# EAGLE design magic-donut (EAGLE 7.5.0)
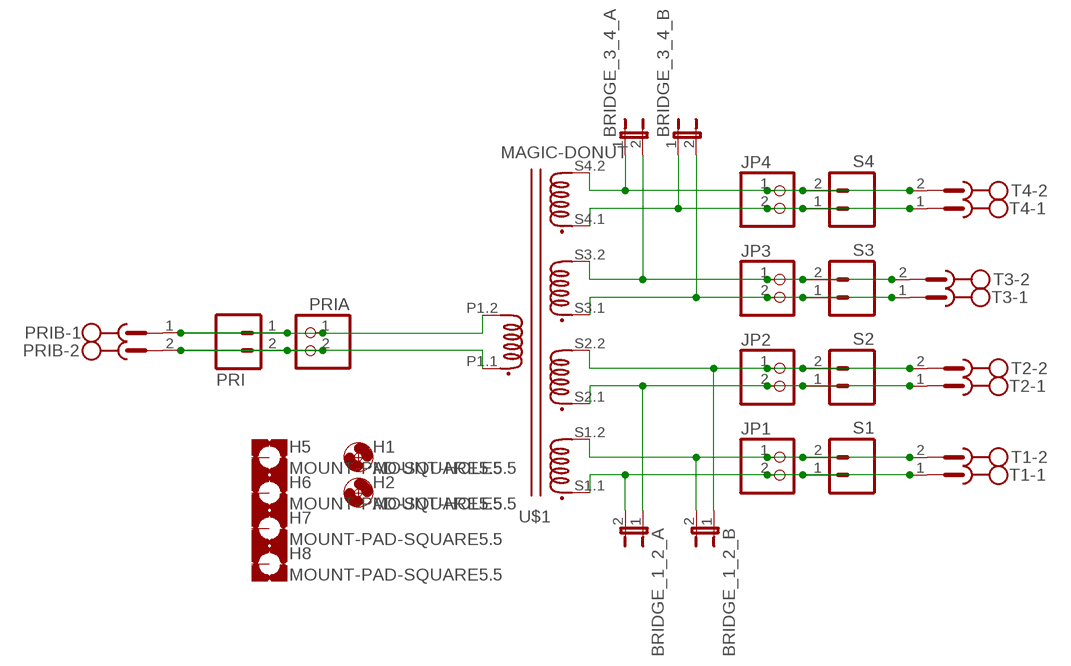
[diagram p0: schematic, sheet 1]

## Parts
BRIDGE_1_2_A  JP1E  [JP1]
BRIDGE_1_2_B  JP1E  [JP1]
BRIDGE_3_4_A  JP1E  [JP1]
BRIDGE_3_4_B  JP1E  [JP1]
H1  MOUNT-HOLE5.5  [5,5]
H2  MOUNT-HOLE5.5  [5,5]
H5  MOUNT-PAD-SQUARE5.5  [5,5-PAD-SQUARE]
H6  MOUNT-PAD-SQUARE5.5  [5,5-PAD-SQUARE]
H7  MOUNT-PAD-SQUARE5.5  [5,5-PAD-SQUARE]
H8  MOUNT-PAD-SQUARE5.5  [5,5-PAD-SQUARE]
JP1  PINHD-1X2  [1X02]
JP2  PINHD-1X2  [1X02]
JP3  PINHD-1X2  [1X02]
JP4  PINHD-1X2  [1X02]
PRI  M02JST-PTH-2  [JST-2-PTH]
PRIA  PINHD-1X2  [1X02]
PRIB  MSTBV2  [MSTBV2]
S1  M02JST-PTH-2  [JST-2-PTH]
S2  M02JST-PTH-2  [JST-2-PTH]
S3  M02JST-PTH-2  [JST-2-PTH]
S4  M02JST-PTH-2  [JST-2-PTH]
T1  MSTBV2  [MSTBV2]
T2  MSTBV2  [MSTBV2]
T3  MSTBV2  [MSTBV2]
T4  MSTBV2  [MSTBV2]
U$1  MAGIC-DONUT  [TOROID]

## Nets
N$1: BRIDGE_1_2_A.2 JP1.2 S1.1 T1.1 U$1.S1.1
N$2: BRIDGE_1_2_A.1 JP2.2 S2.1 T2.1 U$1.S2.1
N$3: BRIDGE_3_4_A.1 JP4.1 S4.2 T4.2 U$1.S4.2
N$4: BRIDGE_3_4_B.1 JP4.2 S4.1 T4.1 U$1.S4.1
N$5: BRIDGE_3_4_A.2 JP3.1 S3.2 T3.2 U$1.S3.2
N$6: BRIDGE_3_4_B.2 JP3.2 S3.1 T3.1 U$1.S3.1
N$7: BRIDGE_1_2_B.1 JP2.1 S2.2 T2.2 U$1.S2.2
N$9: BRIDGE_1_2_B.2 JP1.1 S1.2 T1.2 U$1.S1.2
N$11: PRI.1 PRIA.1 PRIB.1 U$1.P1.2
N$12: PRI.2 PRIA.2 PRIB.2 U$1.P1.1
Unconnected: H5.B5,5(MOUNT) H6.B5,5(MOUNT) H7.B5,5(MOUNT) H8.B5,5(MOUNT)

## Library data of the parts
BRIDGE_1_2_A BRIDGE_1_2_B BRIDGE_3_4_A BRIDGE_3_4_B = jumper:JP1E: JUMPER
H1 H2 = holes:MOUNT-HOLE: MOUNTING HOLE with drill center marker
H5-H8 = holes:MOUNT-PAD-SQUARE: MOUNTING PAD, square
JP1-JP4 PRIA = pinhead:PINHD-1X2: PIN HEADER
PRI S1-S4 = SparkFun-Connectors:M02: Standard 2-pin 0.1" header. Use with - straight break away headers ( PRT-00116) - right angle break away headers (PRT-00553) - swiss pins (PRT-00743) - machine pins (PRT-00117) - female headers (PRT-00115) Molex polarized connector foot print use with: PRT-08233 with associated crimp pins and housings. 2.54_SCREWTERM for use with PRT-10571. 3.5mm Screw Terminal footprints for PRT-08084 5mm Screw Terminal footprints for use with PRT-08432; PROD_ID: CONN-09863; SKU: PRT-09914
PRIB T1-T4 = con-phoenix-500:MSTBV2: PHOENIX; OC_FARNELL: unknown; OC_NEWARK: unknown
U$1 = magic-donut:MAGIC-DONUT

## Board
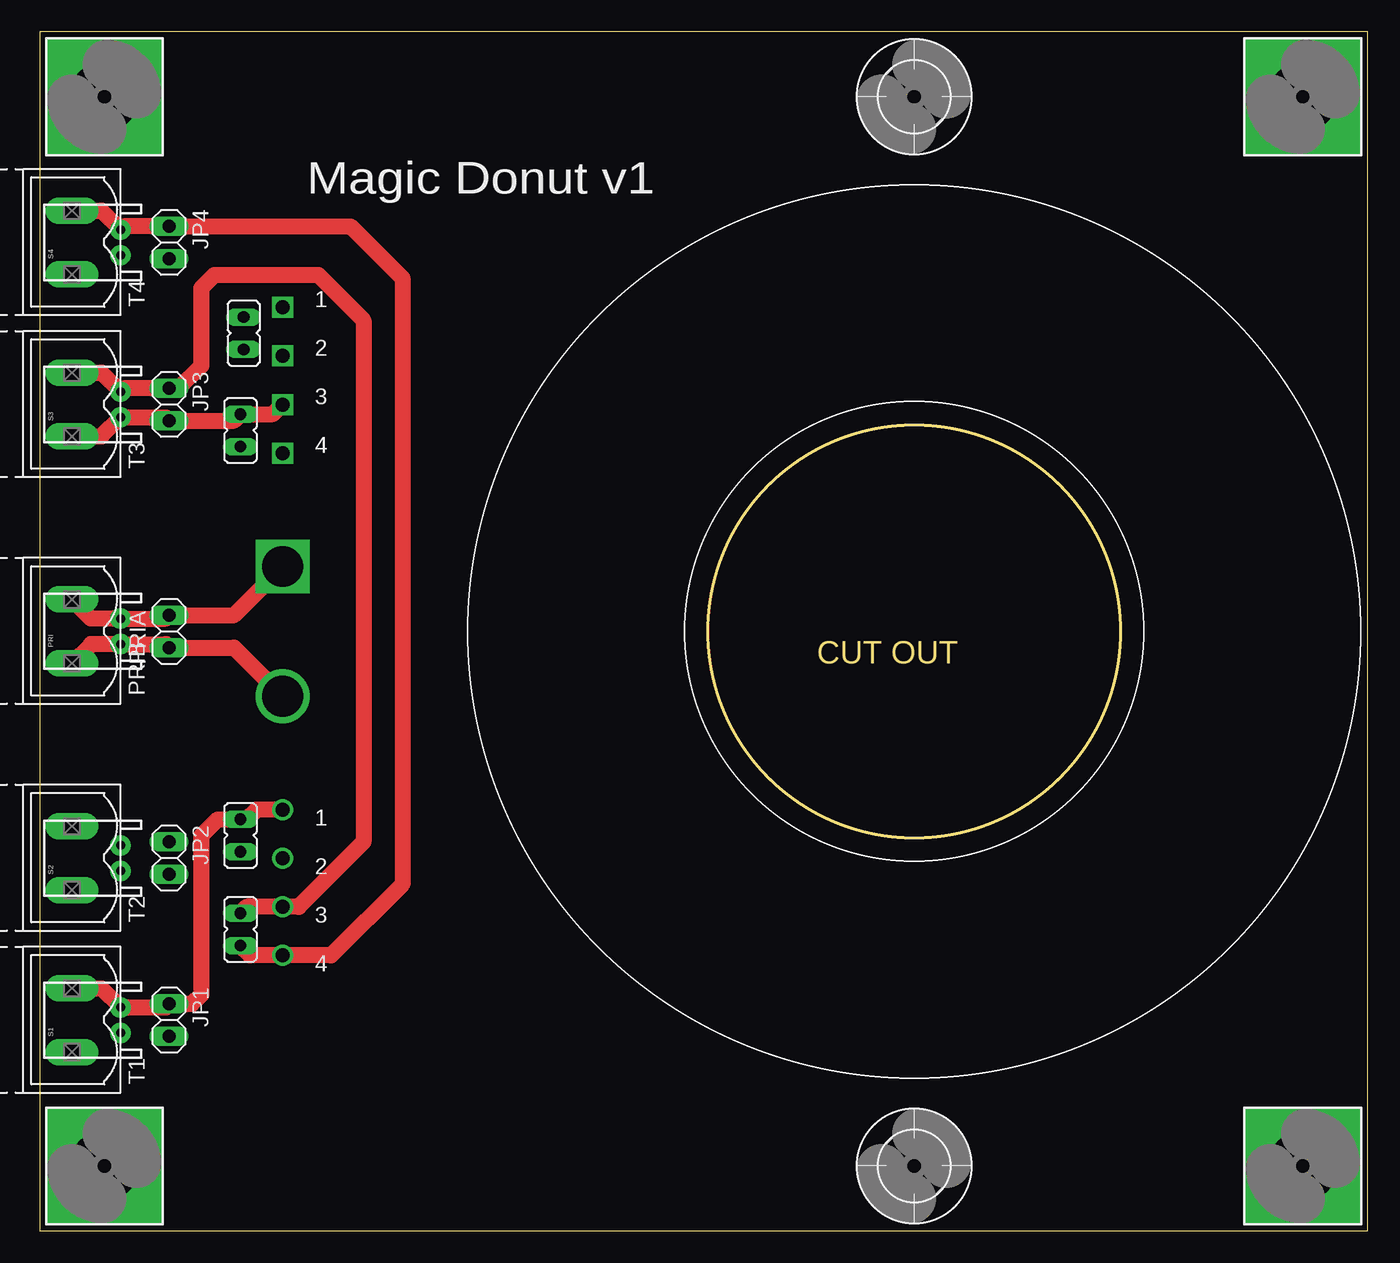
[diagram p1: board, top side]
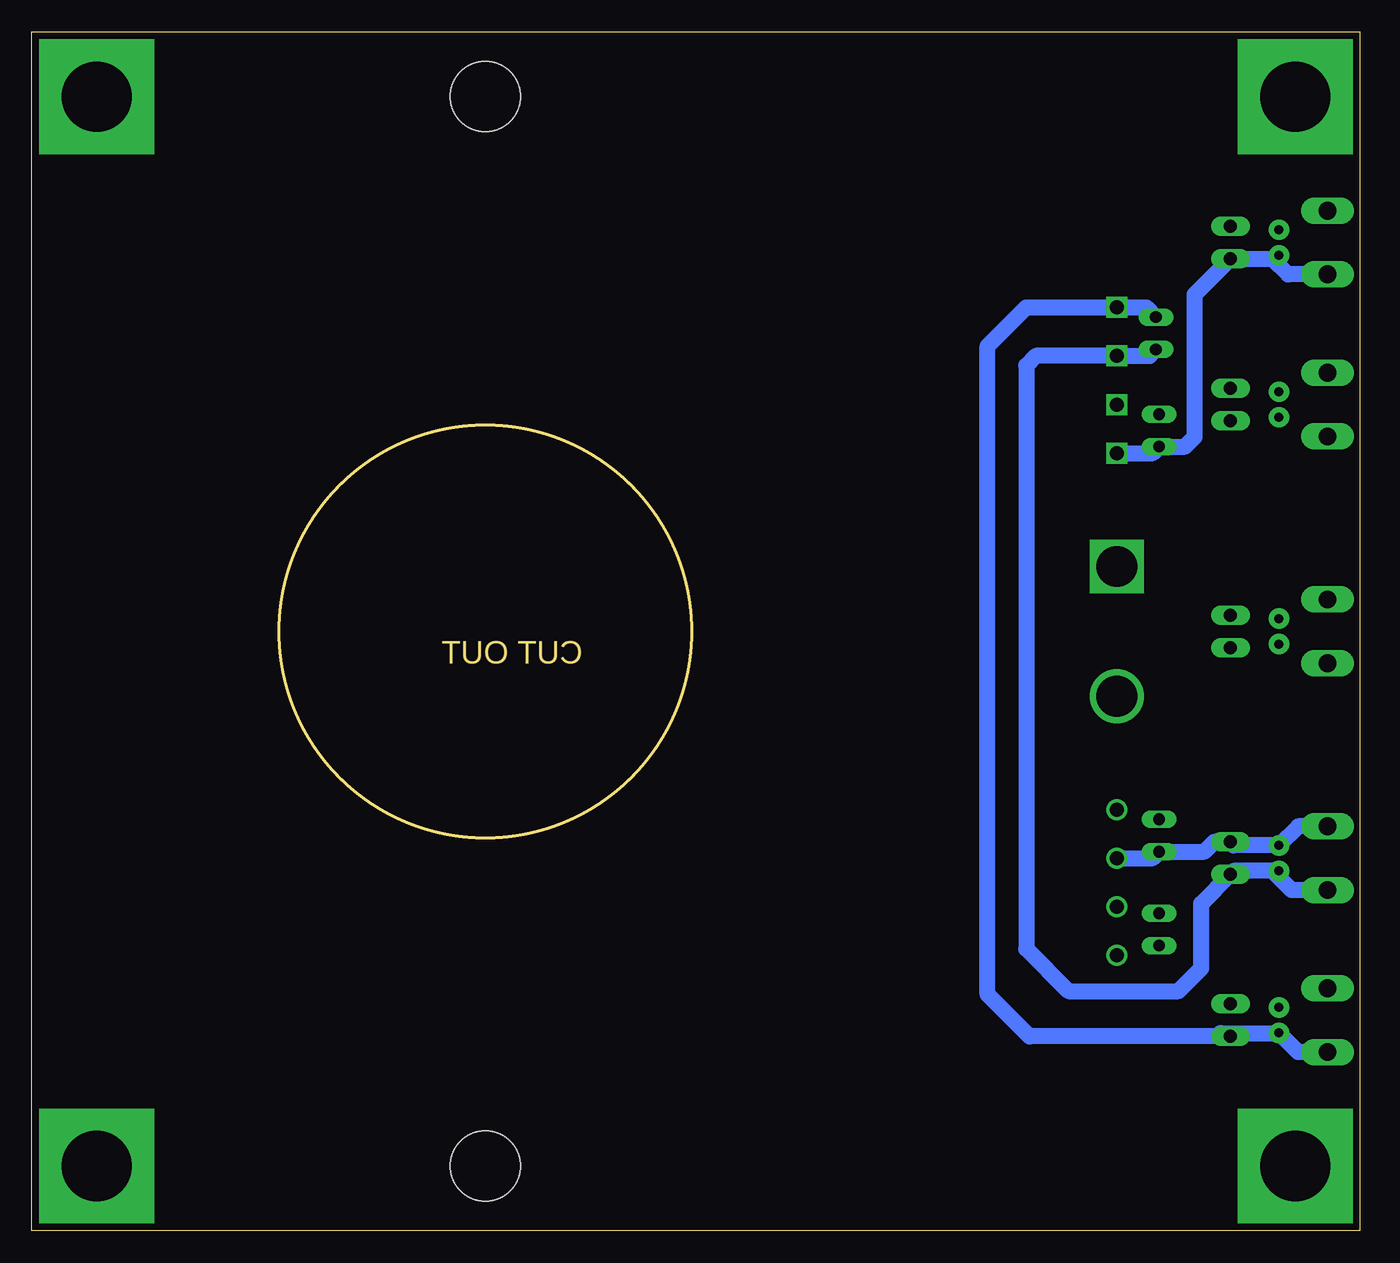
[diagram p2: board, bottom side, seen from below]

Size 104.14 x 93.98 mm. Coordinates in mm from the lower left corner, seen from the top.
Outline: 0,0 104.14,0 104.14,93.98 0,93.98 0,0
Outline: circle at 68.58,46.99 radius 16.16
Copper layers (1*16): Top 0.0356mm / dielectric 1.5011mm / Bottom 0.0356mm
Design rules "oshpark": minimum track width 6mil, minimum drill 13mil, track to track 6mil, track to pad 6mil, pad to pad 6mil, via to via 6mil, smd to smd 6mil, copper to edge 15mil, drill to drill 6mil, minimum pad ring 7mil, minimum via ring 7mil, stop-mask expansion 3mil, vias tented up to drill 0mil, thermal gap 10mil

### Footprints (pad centres in the part's own frame; a part is rotated, then mirrored left to right if it is on the bottom)
JP1 = drill 0.914 long: 1 0,-1.27; 2 0,1.27
5,5 = hole 5.5: 0,0
5,5-PAD-SQUARE = drill 5.5 pad 9 square: B5,5 0,0
1X02 = drill 1.016 long: 1 -1.27,0; 2 1.27,0
JST-2-PTH = drill 0.7 pad 1.6: 1 -1,0; 2 1,0
MSTBV2 = drill 1.397 long: 1 -2.5,0; 2 2.5,0
TOROID = drill 3.2 square: P1.1 -49.53,5.08 | drill 3.2: P1.2 -49.53,-5.08 | drill 1.1 square: S1.1 -49.53,25.4; S2.1 -49.53,21.59; S3.1 -49.53,17.78; S4.1 -49.53,13.97 | drill 1.1: S1.2 -49.53,-13.97; S2.2 -49.53,-17.78; S3.2 -49.53,-21.59; S4.2 -49.53,-25.4

### Placement (x,y rotation side)
BRIDGE_1_2_A  16,70.36 0 top
BRIDGE_1_2_B  15.75,30.99 0 top
BRIDGE_3_4_A  15.75,23.62 0 top
BRIDGE_3_4_B  15.75,62.74 0 top
H1  68.58,88.9 0 top
H2  68.58,5.08 0 top
H5  5.08,5.08 0 top
H6  5.08,88.9 0 top
H7  99.06,5.08 0 top
H8  99.06,88.9 0 top
JP1  10.16,16.51 270 top
JP2  10.16,29.21 270 top
JP3  10.16,64.77 270 top
JP4  10.16,77.47 270 top
PRI  6.35,46.99 90 top
PRIA  10.16,46.99 90 top
PRIB  2.54,46.99 90 top
S1  6.35,16.51 90 top
S2  6.35,29.21 90 top
S3  6.35,64.77 90 top
S4  6.35,77.47 90 top
T1  2.54,16.51 90 top
T2  2.54,29.21 90 top
T3  2.54,64.77 90 top
T4  2.54,77.47 90 top
U$1  68.58,46.99 0 top

### Tracks (layer width: path | path; a pad name or v marks a point on that pad's centre or on a via)
N$1
  Bottom 1.27: BRIDGE_1_2_A.2 16.76,72.39 U$1.S1.1 26.16,72.39 29.21,69.34 29.21,18.54 25.91,15.24 JP1.2 10.67,15.24 10.92,15.49 6.37,15.49 S1.1 4.85,14.01 T1.1
N$2
  Bottom 1.27: S2.1 6.86,28.21 | 6.86,28.21 9.89,28.21 JP2.2 12.45,25.65 12.45,20.57 14.22,18.8 22.86,18.8 26.16,22.1 26.16,67.82 25.4,68.58 U$1.S2.1 16.51,68.58 BRIDGE_1_2_A.1 | T2.1 5.36,26.71 6.86,28.21
N$3
  Top 1.27: BRIDGE_3_4_A.1 16.51,21.59 U$1.S4.2 22.86,21.59 28.45,27.18 28.45,74.68 24.38,78.74 JP4.1 6.62,78.74 S4.2 4.85,79.97 T4.2
N$4
  Bottom 1.27: U$1.S4.1 16.26,60.96 BRIDGE_3_4_B.1 13.72,61.47 12.95,62.23 12.95,73.41 JP4.2 6.86,76.2 | 6.86,76.2 6.62,76.2 S4.1 | T4.1 5.63,74.97 6.86,76.2
N$5
  Top 1.27: BRIDGE_3_4_A.2 16.26,25.4 U$1.S3.2 20.32,25.4 25.4,30.48 25.4,71.37 21.84,74.93 13.72,74.93 12.7,73.91 12.7,67.82 10.92,66.04 JP3.1 6.62,66.04 S3.2 4.85,67.27 T3.2
N$6
  Top 1.27: T3.1 4.85,62.27 S3.1 9.89,63.77 JP3.2 15.24,63.5 BRIDGE_3_4_B.2 18.29,64.01 U$1.S3.1
N$7
  Bottom 1.27: U$1.S2.2 16.26,29.21 BRIDGE_1_2_B.1 12.19,29.72 11.43,30.48 JP2.1 9.89,30.21 S2.2 4.85,31.71 T2.2
N$9
  Top 1.27: T1.2 4.85,19.01 S1.2 9.89,17.51 JP1.1 11.94,17.78 12.7,18.54 12.7,30.99 13.97,32.26 BRIDGE_1_2_B.2 16.26,32.26 17.02,33.02 U$1.S1.2
N$11
  Top 1.27: PRIB.1 4.04,45.99 PRI.1 9.89,45.99 PRIA.1 15.24,45.72 U$1.P1.2
N$12
  Top 1.27: PRIB.2 4.04,47.99 PRI.2 9.89,47.99 PRIA.2 15.24,48.26 U$1.P1.1

### Text on the board
Dimension: CUT OUT
tPlace: Magic Donut v1